# EAGLE design USB to Serial (EAGLE 6.4)
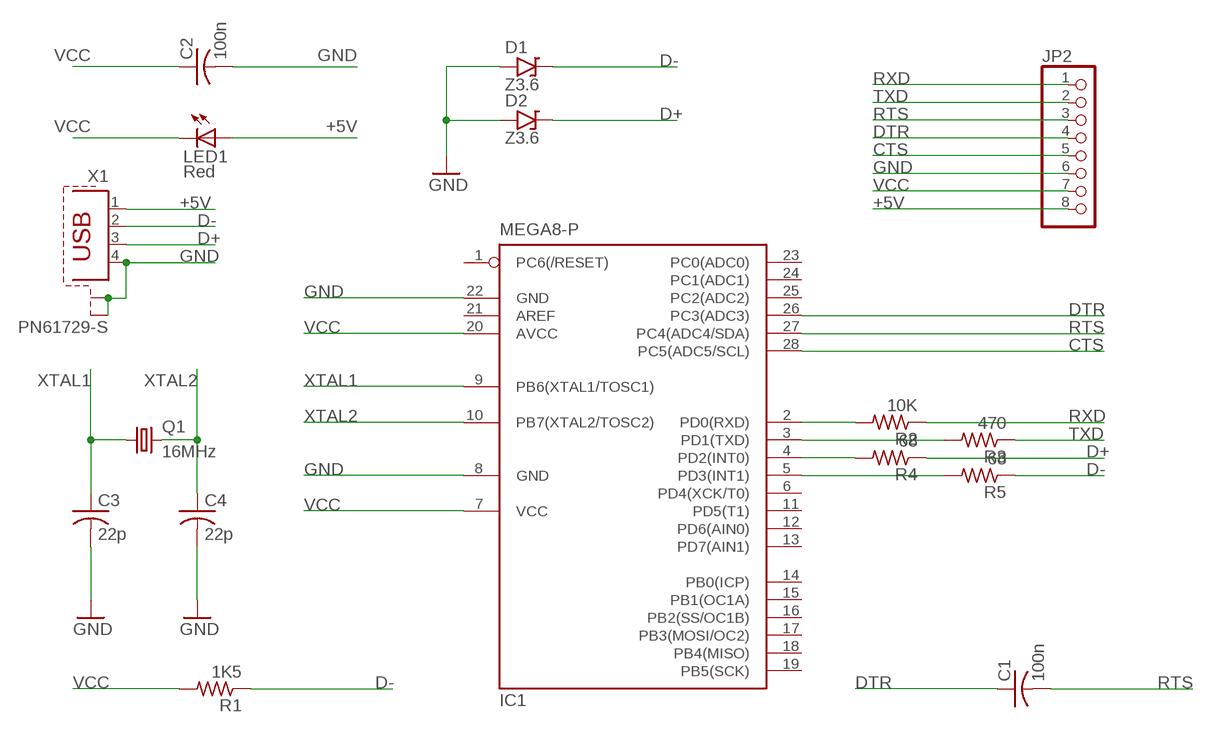
[diagram p0: schematic, sheet 1]

## Parts
C1  100n  C-US050-024X044  [C050-024X044]
C2  100n  C-US050-024X044  [C050-024X044]
C3  22p  C-US050-024X044  [C050-024X044]
C4  22p  C-US050-024X044  [C050-024X044]
D1  Z3.6  1N9ZENER  [DO35-3]
D2  Z3.6  1N9ZENER  [DO35-3]
IC1  MEGA8-P  [DIL28-3]
JP2  PINHD-1X8/90  [1X08/90]
LED1  Red  LED3MM  [LED3MM]
Q1  16MHz  CRYSTALHC49S  [HC49/S]
R1  1K5  R-US_0207/7  [0207/7]
R2  10K  R-US_0207/7  [0207/7]
R3  470  R-US_0207/7  [0207/7]
R4  68  R-US_0207/7  [0207/7]
R5  68  R-US_0207/7  [0207/7]
X1  PN61729-S  [PN61729-S]

## Nets
+5V: JP2.8 LED1.A X1.1
CTS: IC1.28(PC5(ADC5/SCL)) JP2.5
D+: D2.C R4.1 X1.3
D-: D1.C R1.1 R5.1 X1.2
DTR: C1.1 IC1.26(PC3(ADC3)) JP2.4
GND: C2.2 C3.2 C4.2 D1.A D2.A IC1.8(GND) IC1.22(GND) JP2.6 X1.4 X1.S1 X1.S2
N$2: IC1.2(PD0(RXD)) R2.2
N$3: IC1.3(PD1(TXD)) R3.2
N$6: IC1.4(PD2(INT0)) R4.2
N$7: IC1.5(PD3(INT1)) R5.2
RTS: C1.2 IC1.27(PC4(ADC4/SDA)) JP2.3
RXD: JP2.1 R2.1
TXD: JP2.2 R3.1
VCC: C2.1 IC1.7(VCC) IC1.20(AVCC) JP2.7 LED1.K(C) R1.2
XTAL1: C3.1 IC1.9(PB6(XTAL1/TOSC1)) Q1.1
XTAL2: C4.1 IC1.10(PB7(XTAL2/TOSC2)) Q1.2
Unconnected: IC1.1(PC6(/RESET)) IC1.6(PD4(XCK/T0)) IC1.11(PD5(T1)) IC1.12(PD6(AIN0)) IC1.13(PD7(AIN1)) IC1.14(PB0(ICP)) IC1.15(PB1(OC1A)) IC1.16(PB2(SS/OC1B)) IC1.17(PB3(MOSI/OC2)) IC1.18(PB4(MISO)) IC1.19(PB5(SCK)) IC1.21(AREF) IC1.23(PC0(ADC0)) IC1.24(PC1(ADC1)) IC1.25(PC2(ADC2))

## Library data of the parts
C1-C4 = adafruit:C-US: CAPACITOR, American symbol
D1 D2 = gm-diodes:1N9*ZENER: 1N9???B Zener Diode DO-35 case 1N957B - 1N992B (6.8V to 200V)
IC1 = atmel:MEGA8-P: MICROCONTROLLER 8 Kbytes FLASH, 1 kbytes SRAM, 512 bytes EEPROM, USART, 4-channel 10 bit ADC, 2-channel 8 bit ADC Pin compatible with Atmega48, ATMega88, ATMega168 Source: avr.lbr; OC_FARNELL: unknown; OC_NEWARK: unknown
JP2 = pinhead:PINHD-1X8: PIN HEADER
LED1 = adafruit:LED: LED OSRAM: - CHIPLED LG R971, LG N971, LY N971, LG Q971, LY Q971, LO R971, LY R971 LH N974, LH R974 LS Q976, LO Q976, LY Q976 LO Q996 - Hyper CHIPLED LW Q18S LB Q993, LB Q99A, LB R99A - SideLED LS A670, LO A670, LY A670, LG A670, LP A670 LB A673, LV A673, LT A673, LW A673 LH A674 LY A675 LS A676, LA A676, LO A676, LY A676, LW A676 LS A679, LY A679, LG A679 - Hyper Micro SIDELED® LS Y876, LA Y876, LO Y876, LY Y876 LT Y87S - SmartLED LW L88C, LW L88S LB L89C, LB L89S, LG L890 LS L89K, LO L89K, LY L89K LS L896, LA L896, LO L896, LY L896 - TOPLED LS T670, LO T670, LY T670, LG T670, LP T670 LSG T670, LSP T670, LSY T670, LOP T670, LYG T670 LG T671, LOG T671, LSG T671 LB T673, LV T673, LT T673, LW T673 LH T674 LS T676, LA T676, LO T676, LY T676, LB T676, LH T676, LSB T676, LW T676 LB T67C, LV T67C, LT T67C, LS T67K, LO T67K, LY T67K, LW E67C LS E67B, LA E67B, LO E67B, LY E67B, LB E67C, LV E67C, LT E67C LW T67C LS T679, LY T679, LG T679 LS T770, LO T770, LY T770, LG T770, LP T770 LB T773, LV T773, LT T773, LW T773 LH T774 LS E675, LA E675, LY E675, LS T675 LS T776, LA T776, LO T776, LY T776, LB T776 LHGB T686 LT T68C, LB T68C - Hyper Mini TOPLED® LB M676 - Mini TOPLED Santana® LG M470 LS M47K, LO M47K, LY M47K Source: http://www.osram.convergy.de/
Q1 = adafruit:CRYSTAL: CRYSTAL; OC_FARNELL: 1667008; OC_NEWARK: unknown
R1-R5 = adafruit:R-US_: RESISTOR, American symbol
X1 = con-berg:PN61729-S: BERG USB connector; OC_FARNELL: unknown; OC_NEWARK: unknown

## Net classes
0 default: width 0.152 mm, drill 0.241 mm, clearance 0.152 mm

## Board
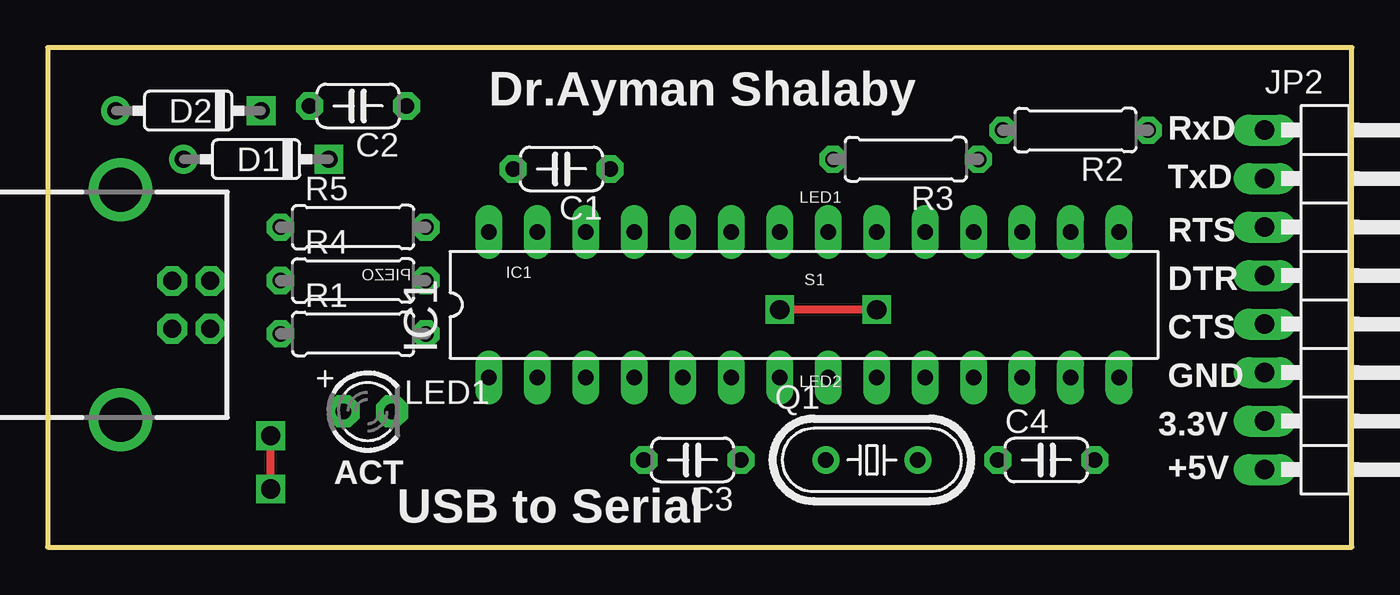
[diagram p1: board, top side]
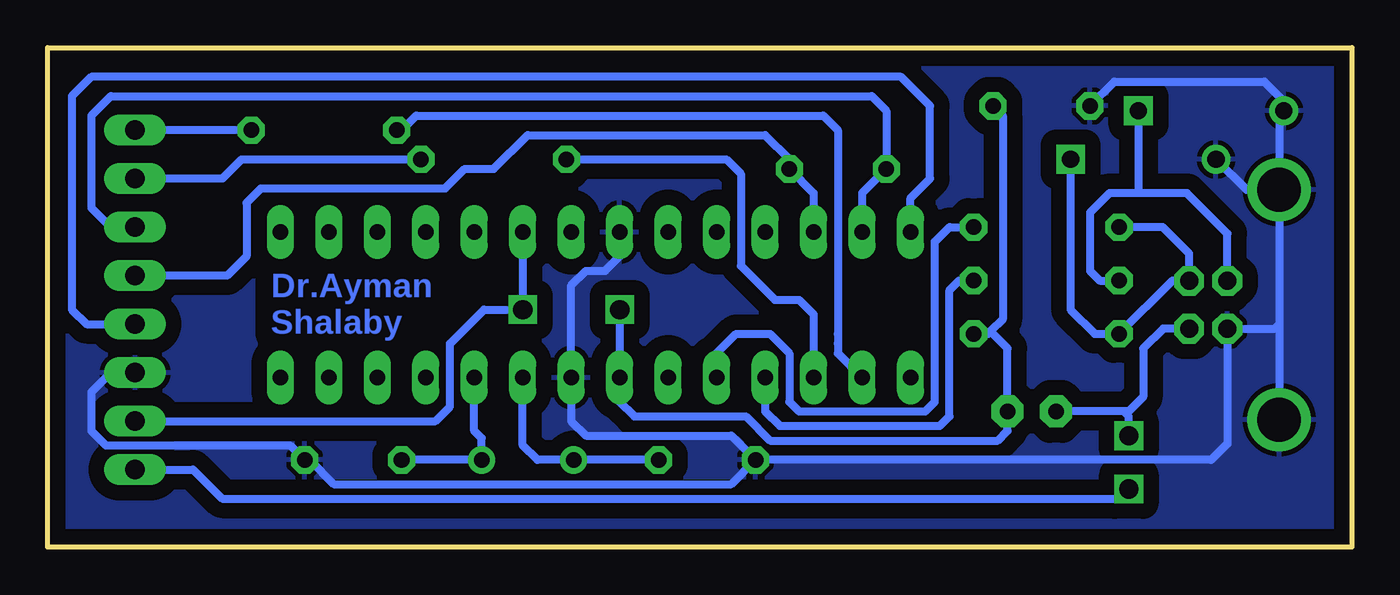
[diagram p2: board, bottom side, seen from below]

Size 68.33 x 26.16 mm. Coordinates in mm from the lower left corner, seen from the top.
Outline: 68.33,26.16 0,26.16 0,0 68.33,0 68.33,26.16
Copper layers (1*16): Top 0.035mm / dielectric 1.5mm / Bottom 0.035mm
Design rules "default *": minimum track width 6mil, minimum drill 9.5mil, track to track 6mil, track to pad 6mil, pad to pad 6mil, via to via 6mil, smd to smd 6mil, copper to edge 18mil, drill to drill 8mil, minimum pad ring 12mil, minimum via ring 4mil, stop-mask expansion 2mil, vias tented up to drill 25mil, thermal gap 10mil

### Footprints (pad centres in the part's own frame; a part is rotated, then mirrored left to right if it is on the bottom)
C050-024X044 = drill 0.813 octagon: 1 -2.54,0; 2 2.54,0
DO35-3 = drill 0.9: A 3.81,0 | drill 0.9 square: C -3.81,0
DIL28-3 = drill 0.813 long: 1 -16.51,-3.81; 2 -13.97,-3.81; 3 -11.43,-3.81; 4 -8.89,-3.81; 5 -6.35,-3.81; 6 -3.81,-3.81; 7 -1.27,-3.81; 8 1.27,-3.81; 9 3.81,-3.81; 10 6.35,-3.81; 11 8.89,-3.81; 12 11.43,-3.81; 13 13.97,-3.81; 14 16.51,-3.81; 15 16.51,3.81; 16 13.97,3.81; 17 11.43,3.81; 18 8.89,3.81; 19 6.35,3.81; 20 3.81,3.81; 21 1.27,3.81; 22 -1.27,3.81; 23 -3.81,3.81; 24 -6.35,3.81; 25 -8.89,3.81; 26 -11.43,3.81; 27 -13.97,3.81; 28 -16.51,3.81
1X08/90 = drill 1.016 long: 1 -8.89,-3.81; 2 -6.35,-3.81; 3 -3.81,-3.81; 4 -1.27,-3.81; 5 1.27,-3.81; 6 3.81,-3.81; 7 6.35,-3.81; 8 8.89,-3.81
LED3MM = drill 0.813 pad 1.676 octagon: A -1.27,0; K 1.27,0
HC49/S = drill 0.813: 1 -2.413,0; 2 2.413,0
0207/7 = drill 0.813 octagon: 1 -3.81,0; 2 3.81,0
PN61729-S = drill 0.95 octagon: 1 1.25,4.71; 2 -1.25,4.71; 3 -1.25,2.71; 4 1.25,2.71 | drill 2.3 pad 2.9: S1 -6.02,0; S2 6.02,0

### Placement (x,y rotation side)
C1  26.92,19.81 180 top
C2  16.26,23.11 180 top
C3  33.78,4.57 180 top
C4  52.32,4.57 0 top
D1  10.92,20.32 180 top
D2  7.37,22.86 180 top
IC1  39.62,12.7 0 top
JP2  67.56,12.95 270 top
LED1  16.76,7.11 0 top
Q1  43.18,4.57 0 top
R1  16,11.18 0 top
R2  53.85,21.84 180 top
R3  44.96,20.32 180 top
R4  16,13.97 0 top
R5  16,16.76 0 top
X1  3.81,12.7 270 top

### Tracks (layer width: path | path; a pad name or v marks a point on that pad's centre or on a via)
+5V  (via drill 1)
  Top 0.406: v11.68,3.05 v11.68,5.84
  Bottom 0.406: X1.1 9.89,11.45 10.92,10.41 10.92,7.87 11.68,7.11 11.94,7.11 | 11.94,7.11 LED1.A | v11.68,3.05 12.19,2.54 59.18,2.54 60.71,4.06 JP2.8 | v11.68,5.84 11.68,6.86 11.94,7.11
CTS
  Bottom 0.406: IC1.28 23.11,18.29 22.1,19.3 22.1,23.11 23.62,24.64 66.04,24.64 67.06,23.62 67.06,12.45 66.29,11.68 JP2.5
D+
  Bottom 0.406: X1.3 6.52,16.43 8.64,18.54 11.18,18.54 | 11.18,18.54 12.7,18.54 13.72,17.53 13.72,14.48 13.21,13.97 R4.1 | D2.C 11.18,18.54
D-
  Bottom 0.406: R5.1 9.91,16.76 8.52,15.38 X1.2 8.54,13.97 9.4,13.97 R1.1 13.46,11.18 14.73,12.45 D1.C
DTR
  Bottom 0.406: IC1.26 28.19,18.54 C1.1 29.46,20.32 30.73,21.59 43.18,21.59 44.96,19.81 46.48,19.81 47.5,18.8 57.15,18.8 57.91,18.03 57.91,15.24 58.93,14.22 JP2.4
GND
  Bottom 0.406: X1.S1 3.81,11.68 | 3.81,11.68 X1.S2 | 3.81,11.68 4.04,11.45 X1.4 6.52,5.42 7.37,4.57 C3.2 | IC1.22 38.35,15.24 39.12,14.48 40.13,14.48 40.89,13.72 IC1.8 40.89,6.6 40.13,5.84 32.51,5.84 C3.2 | C3.2 32.51,3.3 53.34,3.3 54.61,4.57 C4.2 55.63,5.33 65.28,5.33 66.04,6.1 66.04,8.13 65.02,9.14 JP2.6 | X1.S1 3.81,22.61 D2.A 3.56,23.37 4.57,24.38 12.45,24.38 C2.2 | D1.A 5.51,18.72 X1.S1
  pour Bottom (isolate 0.813): 68.33,26.16 0,26.16 -0.25,0 68.07,0
N$2
  Bottom 0.406: IC1.2 26.92,10.16 26.92,10.67 26.92,11.18 26.92,21.84 27.69,22.61 49.02,22.61 49.78,21.84 R2.2
N$3
  Bottom 0.406: R3.2 32.77,20.32 32,19.56 32,14.73 30.23,12.95 28.96,12.95 28.19,12.19 IC1.3
N$6
  Bottom 0.406: R4.2 20.57,13.97 21.08,13.46 21.08,6.86 21.59,6.35 29.97,6.35 30.73,7.11 IC1.4
N$7
  Bottom 0.406: IC1.5 33.27,10.16 32.26,11.18 30.48,11.18 29.46,10.16 29.46,7.62 28.96,7.11 22.35,7.11 21.84,7.62 21.84,16 21.08,16.76 R5.2
RTS
  Bottom 0.406: IC1.27 25.65,18.54 C1.2 24.38,22.86 25.15,23.62 65.02,23.62 66.04,22.61 66.04,17.78 65.02,16.76 JP2.3
RXD
  Bottom 0.406: R2.1 JP2.1
TXD
  Bottom 0.406: R3.1 58.17,20.32 59.18,19.3 JP2.2
VCC  (via drill 1)
  Top 0.406: v43.43,12.45 v38.35,12.45
  Bottom 0.406: 18.92,11.3 18.29,11.94 18.29,22.61 C2.1 | 18.92,11.3 19.05,11.18 R1.2 | 18.92,11.3 18.03,10.41 LED1.K 18.03,6.1 18.54,5.59 30.48,5.59 31.75,6.86 37.59,6.86 38.35,7.62 IC1.7 v38.35,12.45 | IC1.20 v43.43,12.45 45.47,12.45 47.24,10.67 47.24,7.37 48.01,6.6 JP2.7
XTAL1
  Bottom 0.406: C3.1 Q1.1 42.67,4.57 43.43,5.33 IC1.9
XTAL2
  Bottom 0.406: IC1.10 45.97,6.1 45.59,5.71 Q1.2 C4.1

### Text on the board
Bottom: Dr.Ayman / Shalaby
tPlace: Dr.Ayman Shalaby | RxD | TxD | RTS | DTR | CTS | GND | 3.3V | +5V | ACT | USB to Serial
tNames: LED1 | PIEZO | IC1 | S1 | LED2